# EAGLE schematic UinConTX (EAGLE 7.2.0)
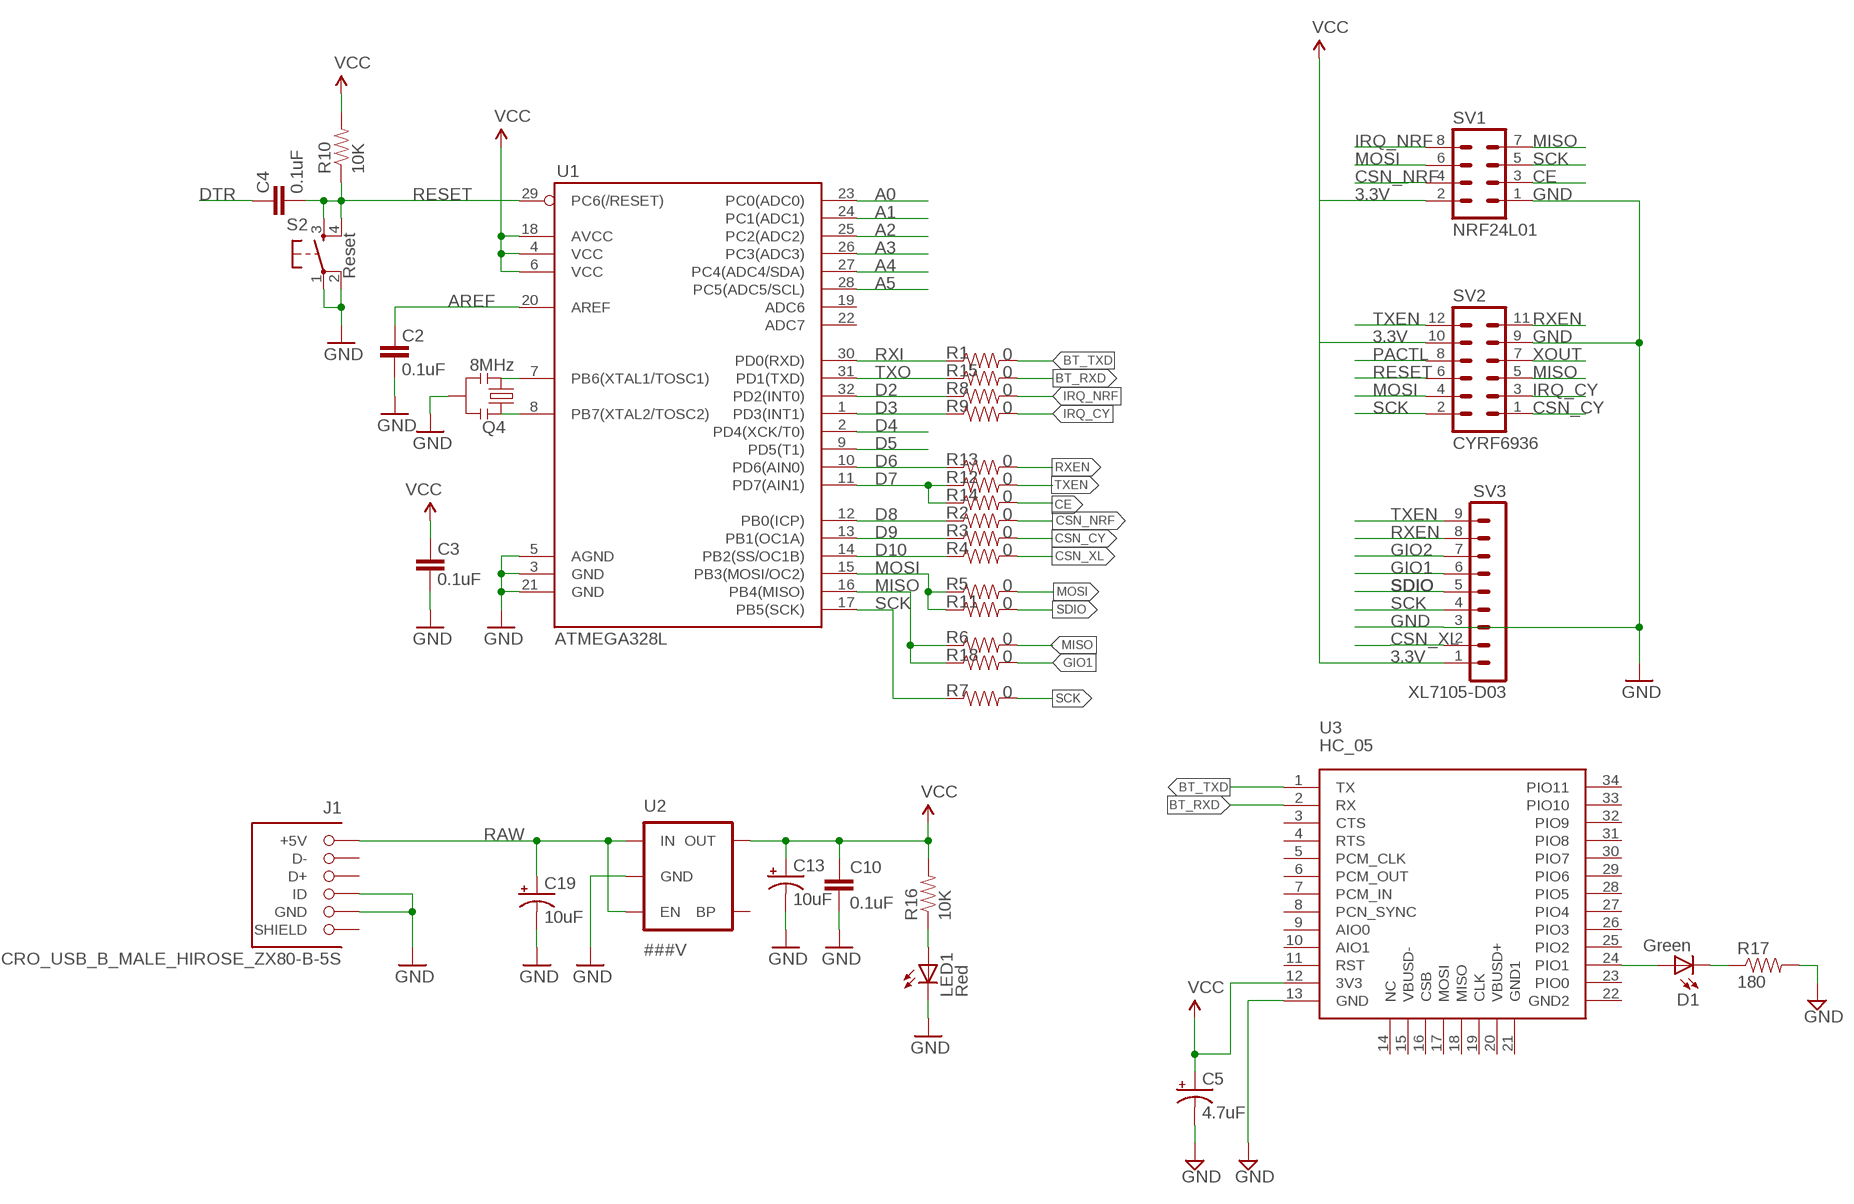
[diagram p0: schematic, sheet 1, part 1 of 2]
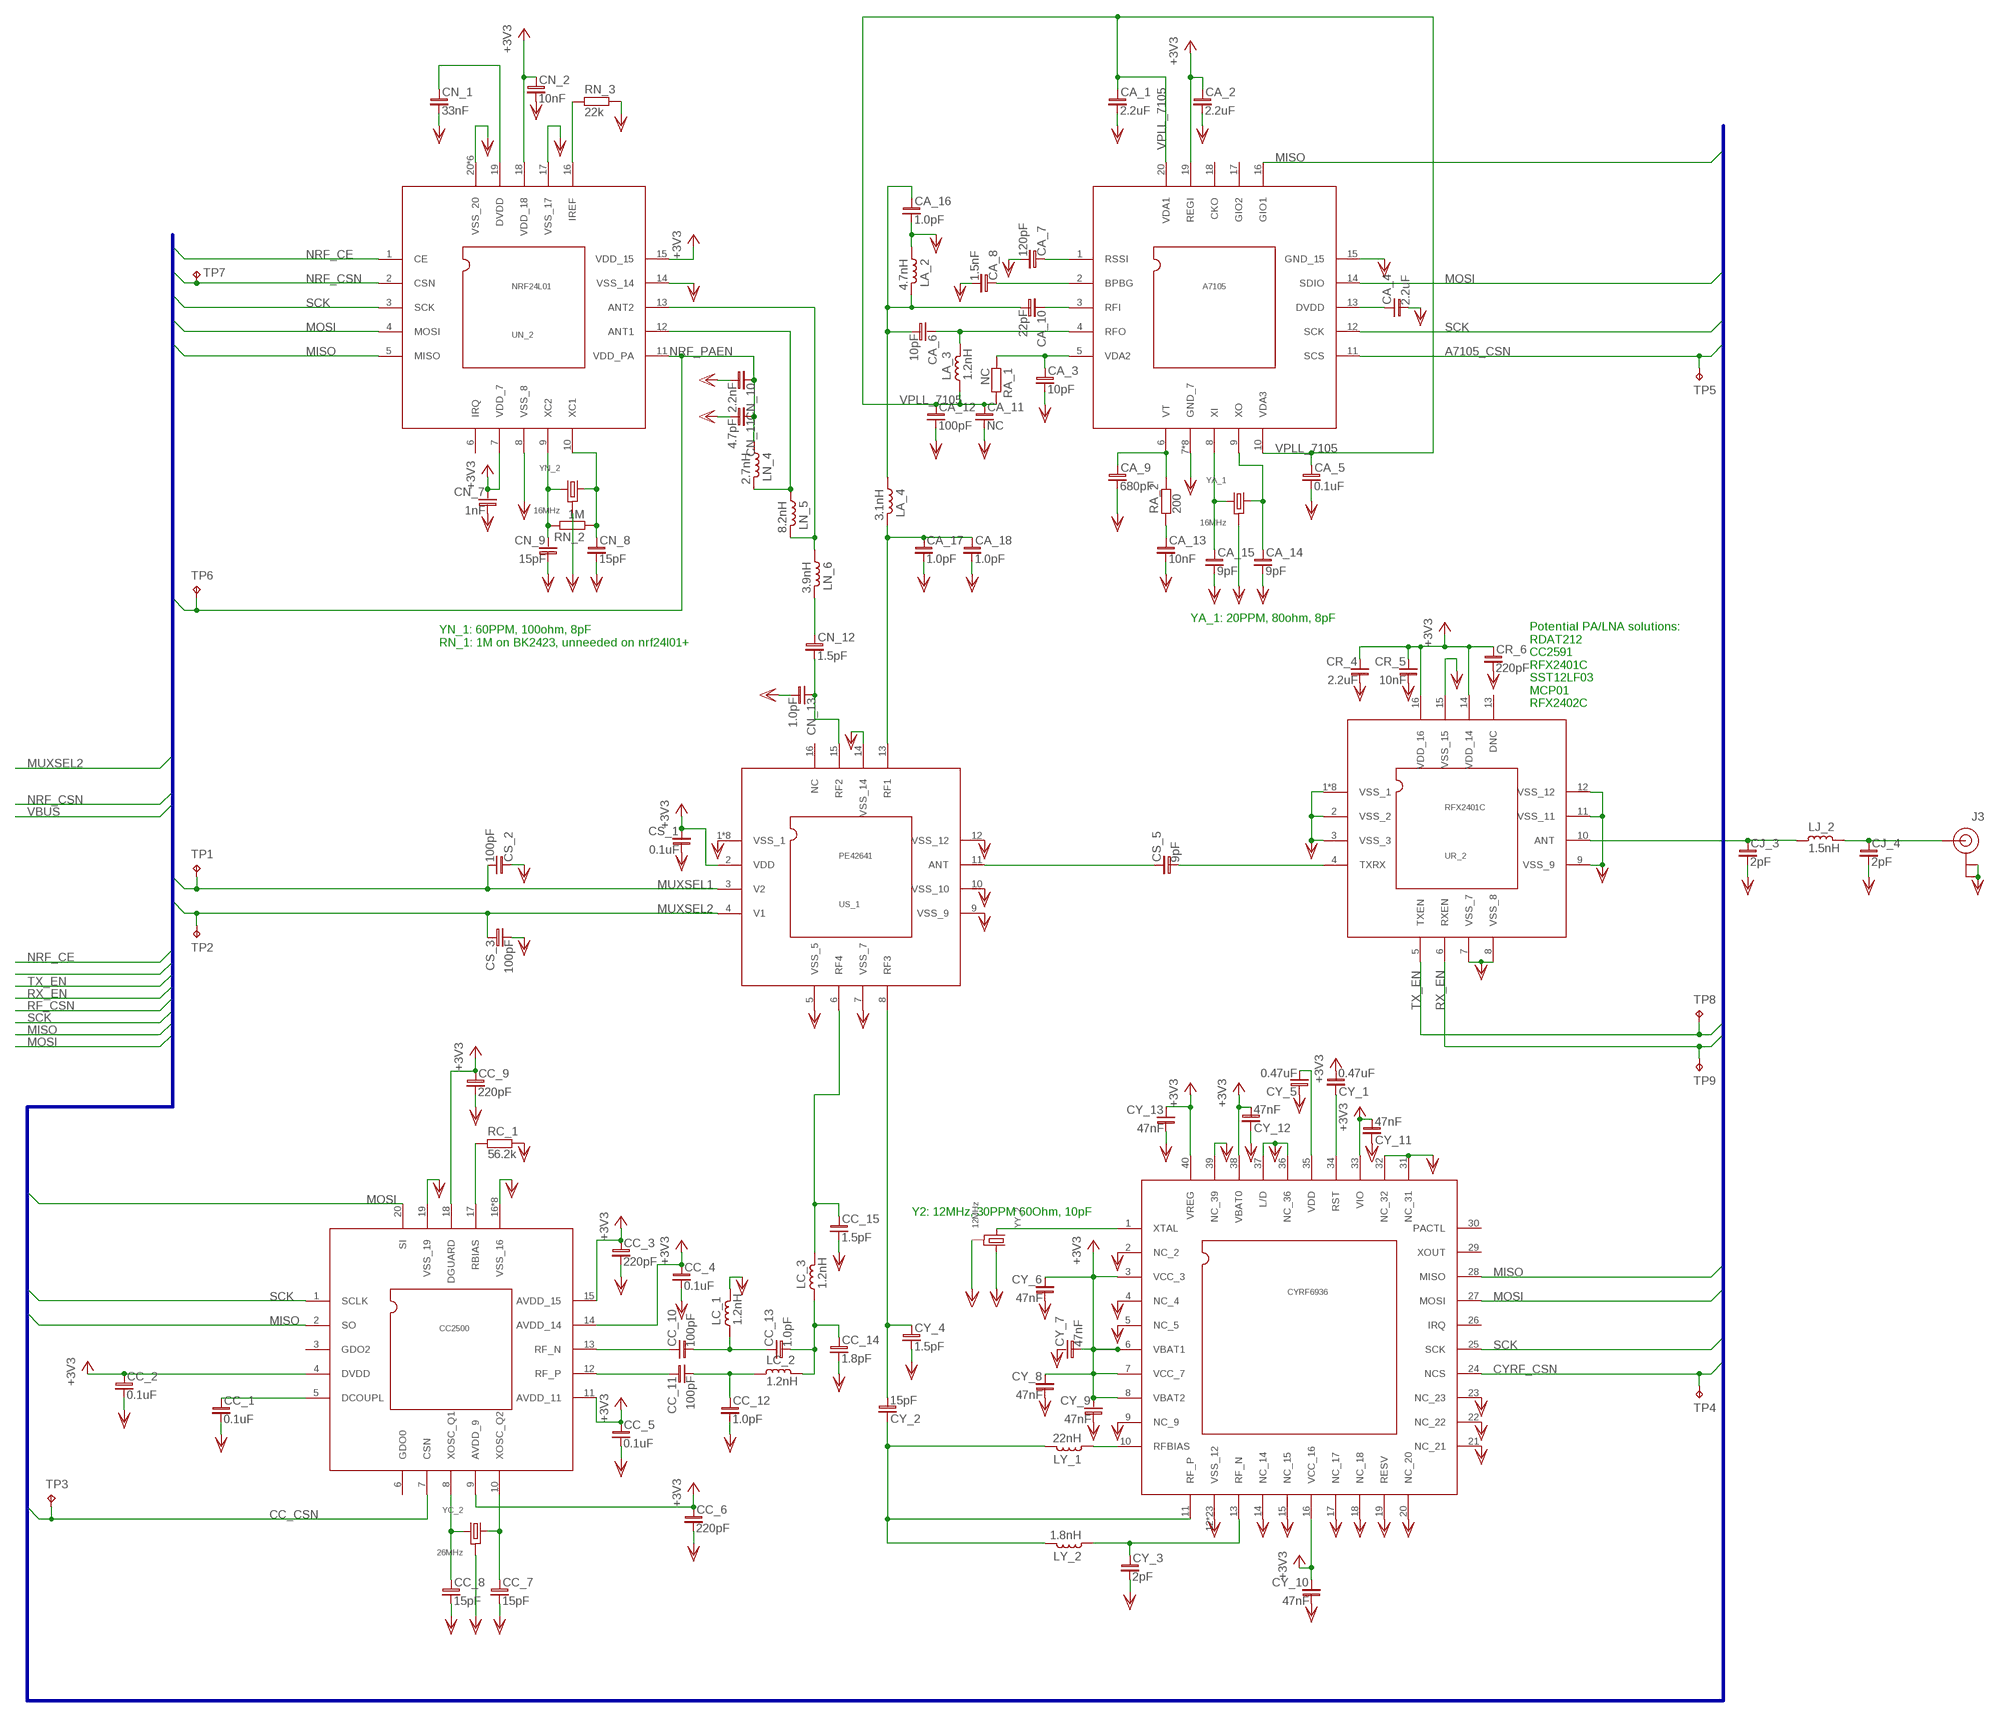
[diagram p1: schematic, sheet 1, part 2 of 2]

## Parts
C2  0.1uF  CAP0402  [C0402]
C3  0.1uF  CAP0402  [C0402]
C4  0.1uF  CAP0402  [C0402]
C5  4.7uF  CPOL-USSANYO_SMD_A5  [SANYO-OSCON_SMD_A5]
C10  0.1uF  CAP0402  [C0402]
C13  10uF  CAP_POL1206  [EIA3216]
C19  10uF  CAP_POL1206  [EIA3216]
CA_1  2.2uF  C_0402  [C0402]
CA_2  2.2uF  C_0402  [C0402]
CA_3  10pF  C_0402  [C0402]
CA_4  2.2uF  C_0402  [C0402]
CA_5  0.1uF  C_0402  [C0402]
CA_6  10pF  C_0402  [C0402]
CA_7  120pF  C_0402  [C0402]
CA_8  1.5nF  C_0402  [C0402]
CA_9  680pF  C_0402  [C0402]
CA_10  22pF  C_0402  [C0402]
CA_11  NC  C_0402  [C0402]
CA_12  100pF  C_0402  [C0402]
CA_13  10nF  C_0402  [C0402]
CA_14  9pF  C_0402  [C0402]
CA_15  9pF  C_0402  [C0402]
CA_16  1.0pF  C_0402  [C0402]
CA_17  1.0pF  C_0402  [C0402]
CA_18  1.0pF  C_0402  [C0402]
CC_1  0.1uF  C_0402  [C0402]
CC_2  0.1uF  C_0402  [C0402]
CC_3  220pF  C_0402  [C0402]
CC_4  0.1uF  C_0402  [C0402]
CC_5  0.1uF  C_0402  [C0402]
CC_6  220pF  C_0402  [C0402]
CC_7  15pF  C_0402  [C0402]
CC_8  15pF  C_0402  [C0402]
CC_9  220pF  C_0402  [C0402]
CC_10  100pF  C_0402  [C0402]
CC_11  100pF  C_0402  [C0402]
CC_12  1.0pF  C_0402  [C0402]
CC_13  1.0pF  C_0402  [C0402]
CC_14  1.8pF  C_0402  [C0402]
CC_15  1.5pF  C_0402  [C0402]
CJ_3  2pF  C_0402  [C0402]
CJ_4  2pF  C_0402  [C0402]
CN_1  33nF  C_0402  [C0402]
CN_2  10nF  C_0402  [C0402]
CN_7  1nF  C_0402  [C0402]
CN_8  15pF  C_0402  [C0402]
CN_9  15pF  C_0402  [C0402]
CN_10  2.2nF  C_0402  [C0402]
CN_11  4.7pF  C_0402  [C0402]
CN_12  1.5pF  C_0402  [C0402]
CN_13  1.0pF  C_0402  [C0402]
CR_4  2.2uF  C_0402  [C0402]
CR_5  10nF  C_0402  [C0402]
CR_6  220pF  C_0402  [C0402]
CS_1  0.1uF  C_0402  [C0402]
CS_2  100pF  C_0402  [C0402]
CS_3  100pF  C_0402  [C0402]
CS_5  9pF  C_0402  [C0402]
CY_1  0.47uF  C_0402  [C0402]
CY_2  15pF  C_0402  [C0402]
CY_3  2pF  C_0402  [C0402]
CY_4  1.5pF  C_0402  [C0402]
CY_5  0.47uF  C_0402  [C0402]
CY_6  47nF  C_0402  [C0402]
CY_7  47nF  C_0402  [C0402]
CY_8  47nF  C_0402  [C0402]
CY_9  47nF  C_0402  [C0402]
CY_10  47nF  C_0402  [C0402]
CY_11  47nF  C_0402  [C0402]
CY_12  47nF  C_0402  [C0402]
CY_13  47nF  C_0402  [C0402]
D1  Green  LED0603  [LED-0603]
J1  MICRO_USB_B_MALE_HIROSE_ZX80-B-5S  [USB_MICRO_B_MALE-HIROSE-ZX80-B-5S]
J3  U.FL  [U.FL]
LA_2  4.7nH  L_0402  [L0402]
LA_3  1.2nH  L_0402  [L0402]
LA_4  3.1nH  L_0402  [L0402]
LC_1  1.2nH  L_0402  [L0402]
LC_2  1.2nH  L_0402  [L0402]
LC_3  1.2nH  L_0402  [L0402]
LED1  Red  LED0603  [LED-0603]
LJ_2  1.5nH  L_0402  [L0402]
LN_4  2.7nH  L_0402  [L0402]
LN_5  8.2nH  L_0402  [L0402]
LN_6  3.9nH  L_0402  [L0402]
LY_1  22nH  L_0402  [L0402]
LY_2  1.8nH  L_0402  [L0402]
Q4  8MHz  RESONATORSMD  [RESONATOR-SMD]
R1  0  RESISTOR0402  [C0402]
R2  0  RESISTOR0402  [C0402]
R3  0  RESISTOR0402  [C0402]
R4  0  RESISTOR0402  [C0402]
R5  0  RESISTOR0402  [C0402]
R6  0  RESISTOR0402  [C0402]
R7  0  RESISTOR0402  [C0402]
R8  0  RESISTOR0402  [C0402]
R9  0  RESISTOR0402  [C0402]
R10  10K  RESISTOR0402  [C0402]
R11  0  RESISTOR0402  [C0402]
R12  0  RESISTOR0402  [C0402]
R13  0  RESISTOR0402  [C0402]
R14  0  RESISTOR0402  [C0402]
R15  0  RESISTOR0402  [C0402]
R16  10K  RESISTOR0402  [C0402]
R17  180  RESISTOR0402  [C0402]
R18  0  RESISTOR0402  [C0402]
RA_1  NC  R_0402  [R0402]
RA_2  200  R_0402  [R0402]
RC_1  56.2k  R_0402  [R0402]
RN_2  1M  R_0402  [R0402]
RN_3  22k  R_0402  [R0402]
S2  Reset  TAC_SWITCHSND  [TACTILE_SWITCH_SMD]
SV1  NRF24L01  MA04-2  [MA04-2]
SV2  CYRF6936  MA06-2  [MA06-2]
SV3  XL7105-D03  MA09-1  [MA09-1]
TP1  TPTP09R  [TP09R]
TP2  TPTP09R  [TP09R]
TP3  TPB1,27  [B1,27]
TP4  TPTP09R  [TP09R]
TP5  TPTP09R  [TP09R]
TP6  TPTP09R  [TP09R]
TP7  TPTP09R  [TP09R]
TP8  TPTP09R  [TP09R]
TP9  TPTP09R  [TP09R]
U1  ATMEGA328L  ATMEGA168  [TQFP32-08]
U2  ###V  V_REG_LDOSMD  [SOT23-5]
U3  HC_05  [BLUETOOTH_SMD]
UA_1  A7105  [A7105]
UC_2  CC2500  [CC2500]
UN_2  NRF24L01  [QFN20-4X4-NRF]
UR_2  RFX2401C  [QFN16-3X3-PAD]
US_1  PE42641  [QFN16-3X3-PAD]
UY_2  CYRF6936  [CYRF6936]
YA_1  16MHz  CRYSTAL.3.2X2.5MM  [3.2X2.5MM]
YC_2  26MHz  CRYSTAL.3.2X2.5MM  [3.2X2.5MM]
YN_2  16MHz  CRYSTAL.3.2X2.5MM  [3.2X2.5MM]
YY_2  12MHz  CRYSTAL.5X3.2MM  [5X3.2MM]

## Nets
3.3V: C5.+ SV1.2 SV2.10 SV3.1 U3.12(3V3) ; supply symbol labelled VCC
+3V3: CA_2.1 CC_2.1 CC_3.1 CC_4.1 CC_5.1 CC_6.1 CC_9.1 CN_2.1 CN_7.1 CR_4.1 CR_5.1 CR_6.1 CS_1.1 CY_1.2 CY_6.1 CY_7.2 CY_8.1 CY_9.1 CY_10.1 CY_11.2 CY_12.2 CY_13.1 UA_1.19(REGI) UC_2.4(DVDD) UC_2.9(AVDD_9) UC_2.11(AVDD_11) UC_2.14(AVDD_14) UC_2.15(AVDD_15) UC_2.18(DGUARD) UN_2.7(VDD_7) UN_2.15(VDD_15) UN_2.18(VDD_18) UR_2.14(VDD_14) UR_2.16(VDD_16) US_1.2(VDD) UY_2.3(VCC_3) UY_2.6(VBAT1) UY_2.7(VCC_7) UY_2.8(VBAT2) UY_2.16(VCC_16) UY_2.33(VIO) UY_2.38(VBAT0) UY_2.40(VREG)
A0: U1.23(PC0(ADC0))
A1: U1.24(PC1(ADC1))
A2: U1.25(PC2(ADC2))
A3: U1.26(PC3(ADC3))
A4: U1.27(PC4(ADC4/SDA))
A5: U1.28(PC5(ADC5/SCL))
A7105_CSN: TP5.TP UA_1.11(SCS)
AREF: C2.2 U1.20(AREF)
BT_RXD: R15.2 U3.2(RX)
BT_TXD: R1.2 U3.1(TX)
CC_CSN: TP3.TP UC_2.7(CSN)
CE: R14.2 SV1.3
CSN_CY: R3.2 SV2.1
CSN_NRF: R2.2 SV1.4
CSN_XL: R4.2 SV3.2
CYRF_CSN: TP4.TP UY_2.24(NCS)
D2: R8.1 U1.32(PD2(INT0))
D3: R9.1 U1.1(PD3(INT1))
D4: U1.2(PD4(XCK/T0))
D5: U1.9(PD5(T1))
D6: R13.1 U1.10(PD6(AIN0))
D7: R12.1 R14.1 U1.11(PD7(AIN1))
D8: R2.1 U1.12(PB0(ICP))
D9: R3.1 U1.13(PB1(OC1A))
D10: R4.1 U1.14(PB2(SS/OC1B))
DTR: C4.2
GIO1: R18.2 SV3.6
GIO2: SV3.7
GND: C2.1 C3.1 C5.- C10.2 C13.C(-) C19.C(-) J1.4(ID) J1.5(GND) LED1.C Q4.2 R17.2 S2.1 S2.2 SV1.1 SV2.9 SV3.3 U1.3(GND) U1.5(AGND) U1.21(GND) U2.2(GND) U3.13(GND)
IRQ_CY: R9.2 SV2.3
IRQ_NRF: R8.2 SV1.8
MISO: R6.1 R6.2 R18.1 SV1.7 SV2.5 U1.16(PB4(MISO)) UA_1.16(GIO1) UC_2.2(SO) UN_2.5(MISO) UY_2.28(MISO)
MOSI: R5.1 R5.2 R11.1 SV1.6 SV2.4 U1.15(PB3(MOSI/OC2)) UA_1.14(SDIO) UC_2.20(SI) UN_2.4(MOSI) UY_2.27(MOSI)
MUXSEL1: CS_2.2 TP1.TP US_1.3(V2)
MUXSEL2: CS_3.1 TP2.TP US_1.4(V1)
N$1: D1.A U3.24(PIO1)
N$2: D1.C R17.1
N$11: Q4.1 U1.8(PB7(XTAL2/TOSC2))
N$12: Q4.3 U1.7(PB6(XTAL1/TOSC1))
N$18: CN_8.1 RN_2.1 UN_2.10(XC1) YN_2.3
N$19: CN_9.1 RN_2.2 UN_2.9(XC2) YN_2.1
N$20: LN_5.1 LN_6.2 UN_2.13(ANT2)
N$21: CN_12.1 LN_6.1
N$22: CN_12.2 CN_13.1 US_1.15(RF2)
N$23: CN_1.1 UN_2.19(DVDD)
N$25: RN_3.1 UN_2.16(IREF)
N$26: CA_9.1 RA_2.2 UA_1.6(VT)
N$27: CA_13.1 RA_2.1
N$28: CA_14.1 UA_1.9(XO) YA_1.3
N$29: CA_15.1 UA_1.8(XI) YA_1.1
N$30: CA_4.1 UA_1.13(DVDD)
N$34: CA_7.1 UA_1.1(RSSI)
N$36: CA_8.1 UA_1.2(BPBG)
N$38: LED1.A R16.1
N$42: CA_10.1 UA_1.3(RFI)
N$48: CA_6.1 LA_3.1 UA_1.4(RFO)
N$49: CA_3.1 RA_1.1 UA_1.5(VDA2)
N$51: CC_1.1 UC_2.5(DCOUPL)
N$52: CC_7.1 UC_2.10(XOSC_Q2) YC_2.3
N$53: CC_8.1 UC_2.8(XOSC_Q1) YC_2.1
N$54: RC_1.1 UC_2.17(RBIAS)
N$55: CC_11.2 CC_12.1 LC_2.2
N$56: CC_10.2 CC_13.1 LC_1.2
N$57: CY_1.1 UY_2.34(RST)
N$58: UY_2.1(XTAL) YY_2.1
N$59: LY_1.2 UY_2.10(RFBIAS)
N$60: CY_2.1 LY_1.1 LY_2.1 UY_2.11(RF_P)
N$61: CY_3.1 LY_2.2 UY_2.13(RF_N)
N$62: CJ_3.1 LJ_2.2 UR_2.10(ANT)
N$63: CA_17.1 CA_18.1 LA_4.1 US_1.13(RF1)
N$64: CA_6.2 CA_10.2 CA_16.1 LA_2.1 LA_4.2
N$65: CC_10.1 UC_2.13(RF_N)
N$66: CC_11.1 UC_2.12(RF_P)
N$67: CC_13.2 CC_14.1 LC_2.1 LC_3.2
N$68: CC_15.1 LC_3.1 US_1.6(RF4)
N$69: CY_2.2 CY_4.1 US_1.8(RF3)
N$70: CJ_4.1 J3.P$3(SIGNAL) LJ_2.1
N$71: LN_4.1 LN_5.2 UN_2.12(ANT1)
N$72: CY_5.2 UY_2.35(VDD)
N$73: CS_5.1 US_1.11(ANT)
N$74: CS_5.2 UR_2.4(TXRX)
NRF_CE: UN_2.1(CE)
NRF_CSN: TP7.TP UN_2.2(CSN)
NRF_PAEN: CN_10.1 CN_11.1 LN_4.2 TP6.TP UN_2.11(VDD_PA)
PACTL: SV2.8
RAW [vcc]: C19.A(+) J1.1(+5V) U2.1(IN) U2.3(EN)
RESET: C4.1 R10.1 S2.3 S2.4 SV2.6 U1.29(PC6(/RESET))
RX_EN: TP9.TP UR_2.6(RXEN)
RXEN: R13.2 SV2.11 SV3.8
RXI: R1.1 U1.30(PD0(RXD))
SCK: R7.1 R7.2 SV1.5 SV2.2 SV3.4 U1.17(PB5(SCK)) UA_1.12(SCK) UC_2.1(SCLK) UN_2.3(SCK) UY_2.25(SCK)
SDIO: R11.2 SV3.5
TX_EN: TP8.TP UR_2.5(TXEN)
TXEN: R12.2 SV2.12 SV3.9
TXO: R15.1 U1.31(PD1(TXD))
VCC: C3.2 C10.1 C13.A(+) R10.2 R16.2 U1.4(VCC) U1.6(VCC) U1.18(AVCC) U2.5(OUT)
VPLL_7105: CA_1.1 CA_5.1 CA_11.1 CA_12.1 LA_3.2 RA_1.2 UA_1.10(VDA3) UA_1.20(VDA1)
VSS: CA_1.2 CA_2.2 CA_3.2 CA_4.2 CA_5.2 CA_7.2 CA_8.2 CA_9.2 CA_11.2 CA_12.2 CA_13.2 CA_14.2 CA_15.2 CA_16.2 CA_17.2 CA_18.2 CC_1.2 CC_2.2 CC_3.2 CC_4.2 CC_5.2 CC_6.2 CC_7.2 CC_8.2 CC_9.2 CC_12.2 CC_14.2 CC_15.2 CJ_3.2 CJ_4.2 CN_1.2 CN_2.2 CN_7.2 CN_8.2 CN_9.2 CN_10.2 CN_11.2 CN_13.2 CR_4.2 CR_5.2 CR_6.2 CS_1.2 CS_2.1 CS_3.2 CY_3.2 CY_4.2 CY_5.1 CY_6.2 CY_7.1 CY_8.2 CY_9.2 CY_10.2 CY_11.1 CY_12.1 CY_13.2 J3.P$1(GND) J3.P$2(GND) LA_2.2 LC_1.1 RC_1.2 RN_3.2 UA_1.7(GND_7) UA_1.15(GND_15) UA_1.21(GND_7) UA_1.22(GND_7) UA_1.P$1(GND_7) UA_1.P$2(GND_7) UA_1.P$3(GND_7) UA_1.P$4(GND_7) UA_1.P$9(GND_7) UC_2.16(VSS_16) UC_2.19(VSS_19) UC_2.21(VSS_16) UC_2.22(VSS_16) UC_2.P$1(VSS_16) UC_2.P$2(VSS_16) UC_2.P$3(VSS_16) UC_2.P$4(VSS_16) UC_2.P$9(VSS_16) UN_2.8(VSS_8) UN_2.14(VSS_14) UN_2.17(VSS_17) UN_2.20(VSS_20) UN_2.P$1(VSS_20) UN_2.P$5(VSS_20) UN_2.P$6(VSS_20) UN_2.P$7(VSS_20) UN_2.P$9(VSS_20) UR_2.1(VSS_1) UR_2.2(VSS_2) UR_2.3(VSS_3) UR_2.7(VSS_7) UR_2.8(VSS_8) UR_2.9(VSS_9) UR_2.11(VSS_11) UR_2.12(VSS_12) UR_2.15(VSS_15) UR_2.17(VSS_1) UR_2.18(VSS_1) UR_2.P$1(VSS_1) UR_2.P$2(VSS_1) UR_2.P$3(VSS_1) UR_2.P$4(VSS_1) UR_2.P$5(VSS_1) US_1.1(VSS_1) US_1.5(VSS_5) US_1.7(VSS_7) US_1.9(VSS_9) US_1.10(VSS_10) US_1.12(VSS_12) US_1.14(VSS_14) US_1.17(VSS_1) US_1.18(VSS_1) US_1.P$1(VSS_1) US_1.P$2(VSS_1) US_1.P$3(VSS_1) US_1.P$4(VSS_1) US_1.P$5(VSS_1) UY_2.2(NC_2) UY_2.4(NC_4) UY_2.5(NC_5) UY_2.9(NC_9) UY_2.12(VSS_12) UY_2.14(NC_14) UY_2.15(NC_15) UY_2.17(NC_17) UY_2.18(NC_18) UY_2.19(RESV) UY_2.20(NC_20) UY_2.21(NC_21) UY_2.22(NC_22) UY_2.23(NC_23) UY_2.31(NC_31) UY_2.32(NC_32) UY_2.36(NC_36) UY_2.37(L/D) UY_2.39(NC_39) UY_2.P$1(VSS_12) UY_2.P$2(VSS_12) UY_2.P$3(VSS_12) UY_2.P$4(VSS_12) UY_2.P$5(VSS_12) UY_2.P$6(VSS_12) UY_2.P$7(VSS_12) UY_2.P$8(VSS_12) UY_2.P$9(VSS_12) UY_2.P$10(VSS_12) UY_2.P$11(VSS_12) UY_2.P$12(VSS_12) UY_2.P$13(VSS_12) UY_2.P$14(VSS_12) UY_2.P$15(VSS_12) UY_2.P$16(VSS_12) UY_2.P$17(VSS_12) UY_2.P$18(VSS_12) UY_2.P$19(VSS_12) UY_2.P$20(VSS_12) UY_2.P$21(VSS_12) UY_2.P$23(VSS_12) YA_1.2(VSS) YA_1.4(VSS) YC_2.2(VSS) YC_2.4(VSS) YN_2.2(VSS) YN_2.4(VSS) YY_2.2(VSS) YY_2.3 YY_2.4(VSS)
XOUT: SV2.7
Unconnected: J1.2(D-) J1.3(D+) J1.SHIELD1(SHIELD) J1.SHIELD2(SHIELD) J1.SHIELD3(SHIELD) J1.SHIELD4(SHIELD) U1.19(ADC6) U1.22(ADC7) U2.4(BP) U3.3(CTS) U3.4(RTS) U3.5(PCM_CLK) U3.6(PCM_OUT) U3.7(PCM_IN) U3.8(PCN_SYNC) U3.9(AIO0) U3.10(AIO1) U3.11(RST) U3.14(NC) U3.15(VBUSD-) U3.16(CSB) U3.17(MOSI) U3.18(MISO) U3.19(CLK) U3.20(VBUSD+) U3.21(GND1) U3.22(GND2) U3.23(PIO0) U3.25(PIO2) U3.26(PIO3) U3.27(PIO4) U3.28(PIO5) U3.29(PIO6) U3.30(PIO7) U3.31(PIO8) U3.32(PIO9) U3.33(PIO10) U3.34(PIO11) UA_1.17(GIO2) UA_1.18(CKO) UC_2.3(GDO2) UC_2.6(GDO0) UN_2.6(IRQ) UR_2.13(DNC) US_1.16(NC) UY_2.26(IRQ) UY_2.29(XOUT) UY_2.30(PACTL)

## Buses
VBUS,SCK,MOSI,MISO,NRF_CSN,CC_CSN,A7105_CSN,CYRF_CSN,UC_CSN,RF_CSN,NRF_PAEN,MUXSEL1,MUXSEL2,TX_EN,RX_EN,NRF_CE

## Notes on the sheet
- YA_1: 20PPM, 80ohm, 8pF
- YN_1: 60PPM, 100ohm, 8pF
  RN_1: 1M on BK2423, unneeded on nrf24l01+
- Potential PA/LNA solutions:
  RDAT212
  CC2591
  RFX2401C
  SST12LF03
  MCP01
  RFX2402C
- Y2: 12MHz, 30PPM 60Ohm, 10pF

## Library data of the parts
C2-C4 C10 = SparkFun:CAP: Capacitor Standard 0603 ceramic capacitor, and 0.1" leaded capacitor.
C5 = rcl:CPOL-US: POLARIZED CAPACITOR, American symbol
C13 C19 = SparkFun:CAP_POL: Capacitor Polarized These are standard SMD and PTH capacitors. Normally 10uF, 47uF, and 100uF in electrolytic and tantalum varieties. Always verify the external diameter of the through hole cap, it varies with capacity, voltage, and manufacturer. The EIA devices should be standard.
CA_1 CA_2 CA_4 CR_4 = rc-master-smd:C_: NON-POLARIZED CAP; DIGIKEY#: 399-7375-1-ND; MANF: Kemet; MANF#: C0402C225M8PACTU; MOUSER#: 80-C0402C225M8P
CA_3 CA_6 = rc-master-smd:C_: NON-POLARIZED CAP; DIGIKEY#: 490-6186-1-ND; MANF: Murata; MANF#: GRM1555C1H100FA01D; MOUSER#: 81-GRM1555C1H100FA1D
CA_5 CC_1 CC_2 CC_4 CC_5 CS_1 = rc-master-smd:C_: NON-POLARIZED CAP; DIGIKEY#: 490-1318-1-ND; MANF: Murata; MANF#: GRM155R61A104KA01D; MOUSER#: 81-GRM155R61A104KA1D
CA_7 = rc-master-smd:C_: NON-POLARIZED CAP; DIGIKEY#: 490-8183-1-ND; MANF: Murata; MANF#: GRM1555C1H121GA01D; MOUSER#: 81-GRM1555C1H121GA1D
CA_8 = rc-master-smd:C_: NON-POLARIZED CAP; DIGIKEY#: 490-6354-1-ND; MANF: Murata; MANF#: GRM155R71H152KA01J; MOUSER#: 81-GRM155R71H152KA1J
CA_9 = rc-master-smd:C_: NON-POLARIZED CAP; DIGIKEY#: 490-3240-1-ND; MANF: Murata; MANF#: GRM1555C1H681JA01D; MOUSER#: 81-GRM1555C1H681JA1D
CA_10 = rc-master-smd:C_: NON-POLARIZED CAP; DIGIKEY#: 490-8173-1-ND; MANF: Murata; MANF#: GRM1555C1E220GA01D; MOUSER#: 81-GRM1555C1E220GA1D
CA_11 = rc-master-smd:C_: NON-POLARIZED CAP
CA_12 CC_10 CC_11 CS_2 CS_3 = rc-master-smd:C_: NON-POLARIZED CAP; DIGIKEY#: 490-6188-1-ND; MANF: Murata; MANF#: GRM1555C1H101GA01D; MOUSER#: 81-GRM1555C1H101GA1D
CA_13 CN_2 CR_5 = rc-master-smd:C_: NON-POLARIZED CAP; DIGIKEY#: 490-1313-1-ND; MANF: Murata; MANF#: GRM155R71C103KA01D; MOUSER#: 81-GRM155R71C103KA1D
CA_14 CA_15 CS_5 = rc-master-smd:C_: NON-POLARIZED CAP; DIGIKEY#: 490-6257-1-ND; MANF: Murata; MANF#: GRM1555C1H9R0BA01D; MOUSER#: 81-GRM1555C1H9R0BA1D
CA_16-CA_18 CC_12 CC_13 CN_13 = rc-master-smd:C_: NON-POLARIZED CAP; DIGIKEY#: 490-6206-1-ND; MANF: Murata; MANF#: GRM1555C1H1R0BA01D; MOUSER#: 81-GRM1555C1H1R0BA1D
CC_3 CC_6 CC_9 CR_6 = rc-master-smd:C_: NON-POLARIZED CAP; DIGIKEY#: 490-1293-1-ND; MANF: Murata; MANF#: GRM1555C1H221JA01D; MOUSER#: 81-GRM1555C1H221JA1D
CC_7 CC_8 CN_8 CN_9 CY_2 = rc-master-smd:C_: NON-POLARIZED CAP; DIGIKEY#: 490-6200-1-ND; MANF: Murata; MANF#: GRM1555C1H150FA01D; MOUSER#: 81-GRM1555C1H150FA1D
CC_14 = rc-master-smd:C_: NON-POLARIZED CAP; DIGIKEY#: 490-6215-1-ND; MANF: Murata; MANF#: GRM1555C1H1R8BA01D; MOUSER#: 81-GRM1555C1H1R8BA1D
CC_15 CN_12 CY_4 = rc-master-smd:C_: NON-POLARIZED CAP; DIGIKEY#: 490-6212-1-ND; MANF: Murata; MANF#: GRM1555C1H1R5BA01D; MOUSER#: 81-GRM1555C1H1R5BA1D
CJ_3 CJ_4 CY_3 = rc-master-smd:C_: NON-POLARIZED CAP; DIGIKEY#: 490-6226-1-ND; MANF: Murata; MANF#: GRM1555C1H2R0BA01D; MOUSER#: 81-GRM1555C1H2R0BA1D
CN_1 = rc-master-smd:C_: NON-POLARIZED CAP; DIGIKEY#: 490-6333-1-ND; MANF: Murata; MANF#: GRM155R71C333KA01J; MOUSER#: 81-GRM155R71C333KA1J
CN_7 = rc-master-smd:C_: NON-POLARIZED CAP; DIGIKEY#: 490-3244-1-ND; MANF: Murata; MANF#: GRM1555C1H102JA01D; MOUSER#: 81-GRM1555C1H102JA1D
CN_10 = rc-master-smd:C_: NON-POLARIZED CAP; DIGIKEY#: 490-6358-1-ND; MANF: Murata; MANF#: GRM155R71H222JA01D; MOUSER#: 81-GRM155R71H222JA1D
CN_11 = rc-master-smd:C_: NON-POLARIZED CAP; DIGIKEY#: 490-6244-1-ND; MANF: Murata; MANF#: GRM1555C1H4R7BA01D; MOUSER#: 81-GRM1555C1H4R7BA1D
CY_1 CY_5 = rc-master-smd:C_: NON-POLARIZED CAP; DIGIKEY#: 490-3266-1-ND; MANF: Murata; MANF#: GRM155R60J474KE19D; MOUSER#: 81-GRM155R60J474KE9D
CY_6-CY_13 = rc-master-smd:C_: NON-POLARIZED CAP; DIGIKEY#: 490-6473-1-ND; MANF: Murata; MANF#: GRM155R71C473KA01J; MOUSER#: 81-GRM155R71C473KA1J
D1 LED1 = SparkFun:LED: LEDs Standard schematic elements and footprints for 5mm, 3mm, 1206, and 0603 sized LEDs. 5mm - Spark Fun Electronics SKU : COM-00529 (and others)
J1 = connector:MICRO_USB_B_MALE_HIROSE_ZX80-B-5S: CONN PLUG MCR USB B PCB VERT; DIGIKEY: H11612-ND
J3 = UniversalTx:U.FL: SMD antenna connector- WRL-09144; DIGIKEY#: WM5587CT-ND; MANF: Molex; MANF#: 0734120110; PROD_ID: CONN-09193
LA_2 = rc-master-smd:L_: INDUCTOR; DIGIKEY#: PCD1906CT-ND; MANF: Panasonic; MANF#: ELJ-RF4N7ZFB; MOUSER#: 667-ELJ-RF4N7ZFB
LA_3 LC_1-LC_3 = rc-master-smd:L_: INDUCTOR; DIGIKEY#: PCD1899CT-ND; MANF: Panasonic; MANF#: ELJ-RF1N2ZFB; MOUSER#: 667-ELJ-RF1N2ZFB
LA_4 = rc-master-smd:L_: INDUCTOR; DIGIKEY#: 535-10372-1-ND; MANF: Abracon; MANF#: ATFC-0402-3N1-BT
LJ_2 = rc-master-smd:L_: INDUCTOR; DIGIKEY#: PCD1900CT-ND; MANF: Panasonic; MANF#: ELJ-RF1N5ZFB; MOUSER#: 667-ELJ-RF1N5ZFB
LN_4 = rc-master-smd:L_: INDUCTOR; DIGIKEY#: PCD1903CT-ND; MANF: Panasonic; MANF#: ELJ-RF2N7ZFB; MOUSER#: 667-ELJ-RF2N7ZFB
LN_5 = rc-master-smd:L_: INDUCTOR; DIGIKEY#: PCD1909CT-ND; MANF: Panasonic; MANF#: ELJ-RF8N2ZFB; MOUSER#: 667-ELJ-RF8N2ZFB
LN_6 = rc-master-smd:L_: INDUCTOR; DIGIKEY#: PCD1905CT-ND; MANF: Panasonic; MANF#: ELJ-RF3N9ZFB; MOUSER#: 667-ELJ-RF3N9ZFB
LY_1 = rc-master-smd:L_: INDUCTOR; DIGIKEY#: PCD1914CT-ND; MANF: Panasonic; MANF#: ELJ-RF22NGFB; MOUSER#: 667-ELJ-RF22NGFB
LY_2 = rc-master-smd:L_: INDUCTOR; DIGIKEY#: PCD1901CT-ND; MANF: Panasonic; MANF#: ELJ-RF1N8ZFB; MOUSER#: 667-ELJ-RF1N8ZFB
Q4 = SparkFun:RESONATOR: Resonator Small SMD resonator. This is the itty bitty 10/20MHz resonators with built in caps. CSTCE10M0G55 and CSTCE20M0V53. Footprint has been reviewed closely but hasn't been tested yet.
R1-R18 = SparkFun:RESISTOR: Resistor Basic schematic elements and footprints for 0603, 1206, and PTH 1/10th watt (small) resistors.
RA_1 = rc-master-smd:R_: RESISTOR
RA_2 = rc-master-smd:R_: RESISTOR; DIGIKEY#: P200JCT-ND; MANF: Panasonic; MANF#: ERJ-2GEJ201X; MOUSER#: 667-ERJ-2GEJ201X
RC_1 = rc-master-smd:R_: RESISTOR; DIGIKEY#: P56.2KLCT-ND; MANF: Panasonic; MANF#: ERJ-2RKF5622X; MOUSER#: 667-ERJ-2RKF5622X
RN_2 = rc-master-smd:R_: RESISTOR; DIGIKEY#: P1.0MJCT-ND; MANF: Panasonic; MANF#: ERJ-2GEJ105X; MOUSER#: 667-ERJ-2GEJ105X
RN_3 = rc-master-smd:R_: RESISTOR; DIGIKEY#: P22KJCT-ND; MANF: Panasonic; MANF#: ERJ-2GEJ223X; MOUSER#: 667-ERJ-2GEJ223X
S2 = SparkFun:TAC_SWITCH: Momentary Switch Button commonly used for reset or general input. Spark Fun Electronics SKU : COM-00097
SV1 = con-lstb:MA04-2: PIN HEADER; OC_FARNELL: unknown; OC_NEWARK: unknown
SV2 = con-lstb:MA06-2: PIN HEADER; OC_FARNELL: unknown; OC_NEWARK: unknown
SV3 = con-lstb:MA09-1: PIN HEADER; OC_FARNELL: unknown; OC_NEWARK: unknown
TP1-TP9 = testpad:TP: Test pad
U1 = SparkFun:ATMEGA168
U2 = SparkFun:V_REG_LDO: Voltage Regulator LDO Standard 150mA LDO voltage regulator in SOT-23 layout. Micrel part MIC5205. BP (by-pass) pin is used to lower output noise with 470pF cap.
U3 = SerialPortBluetooth:HC_05
UA_1 = UniversalTx:A7105; MANF: Amiccom
UC_2 = UniversalTx:CC2500; DIGIKEY#: 296-19586-2-ND; MANF: TI; MANF#: CC2500RTKR
UN_2 = UniversalTx:NRF24L01: nRF24L01 Single chip 2.4GHz transceiver from Nordic Semiconductors.; DIGIKEY#: 1490-1033-1-ND; MANF: Nordic; MANF#: NRF24L01P-R7
UR_2 = UniversalTx:RFX2401C; MANF: RF Axis; MANF#: RFX2401C
US_1 = UniversalTx:PE42641
UY_2 = UniversalTx:CYRF6936; DIGIKEY#: 428-2962-ND; MANF: Cypress; MANF#: CYRF6936-40LTXC
YA_1 YN_2 = UniversalTx:CRYSTAL; DIGIKEY#: SER3628CT-ND; MANF: EPSON; MANF#: TSX-3225 16.0000MF09Z-AC3
YC_2 = UniversalTx:CRYSTAL; DIGIKEY#: 535-10916-1-ND; MANF: ABRACON; MANF#: ABM8G-26.000MHZ-4Y-T3
YY_2 = UniversalTx:CRYSTAL; DIGIKEY#: CTX833CT-ND; MANF: CTS; MANF#: 405C11A12M00000

## Net classes
1 vcc: width 0.254 mm